# EAGLE board E-book_Reader (EAGLE 9.7.0)
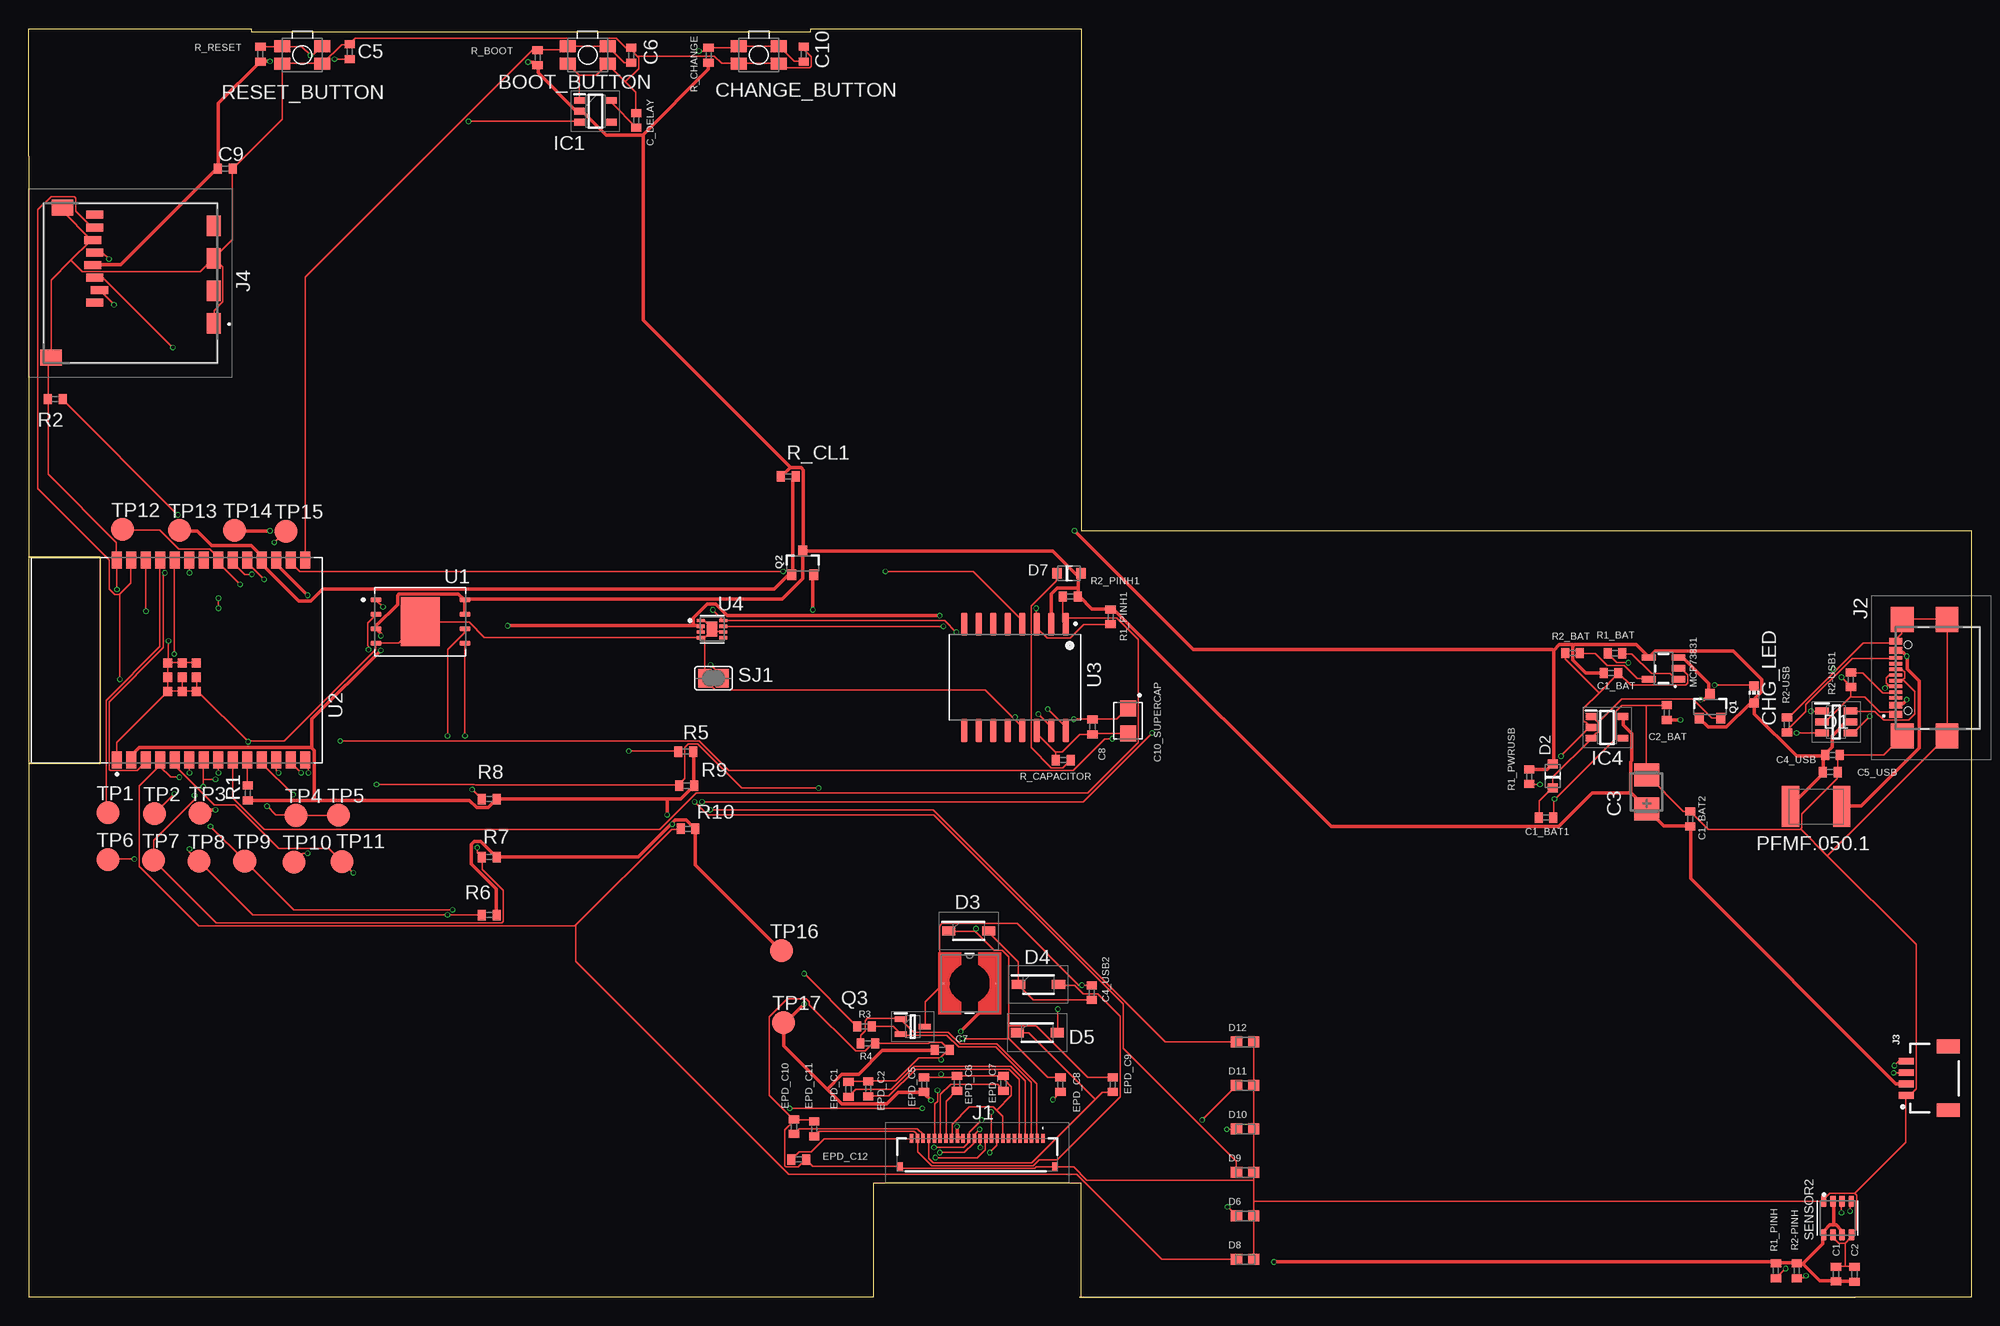
[diagram p1: board, top side]
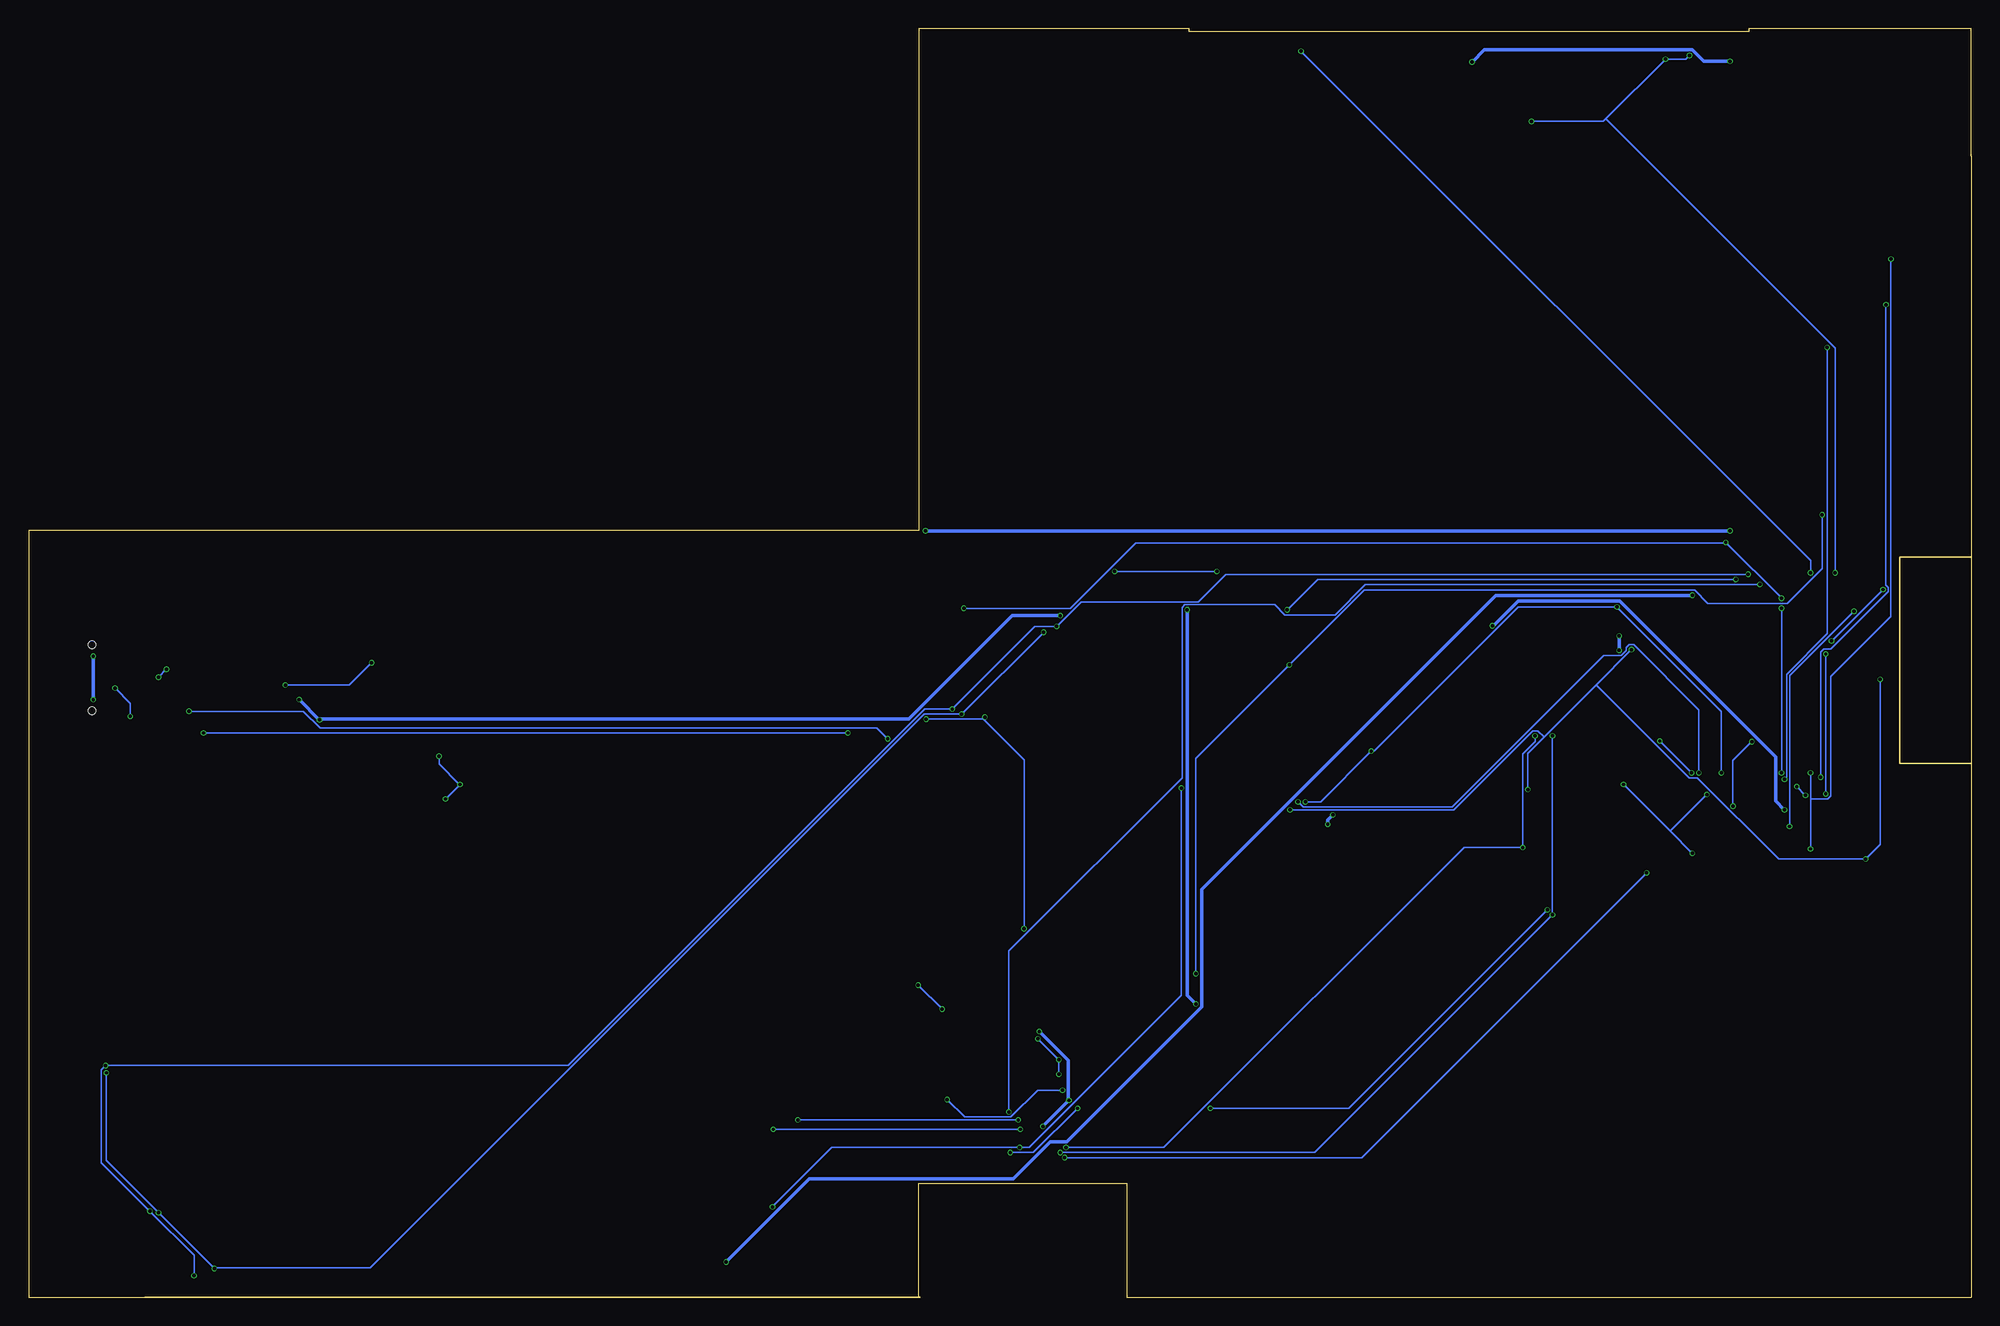
[diagram p2: board, bottom side, seen from below]

Size 170.2 x 111.2 mm. Coordinates in mm from the lower left corner, seen from the top.
Outline: 92.1,0 160,0
Outline: 0,64.9 0,100 0,111.2 19.5,111.2 19.5,110.9 68.5,110.9 68.5,111.2 92.2,111.2 92.2,67.2 170.2,67.2 170.2,0 92.1,0
Outline: 0,64.9 0,46.8
Outline: 0,46.8 0,0 74,0 74,10 92.2,10 92.2,0.1 92.1,0
Outline: 0,64.9 6.26,64.9 6.26,46.8 0,46.8
Copper layers (1*16): Top 0.035mm / dielectric 1.6mm / Bottom 0.035mm
Design rules "jlcpcb-2layers.dru *": minimum track width 5mil, minimum drill 0.3mm, track to track 5mil, track to pad 5mil, pad to pad 5mil, via to via 5mil, smd to smd 5mil, copper to edge 0.2mm, drill to drill 6mil, minimum pad ring 10mil, minimum via ring 3mil, stop-mask expansion 4mil, vias tented up to drill 0mil, thermal gap 10mil
Net classes: 1 power: width 0.3 mm

## Footprints (pad centres in the part's own frame; a part is rotated, then mirrored left to right if it is on the bottom)
MYBUTTON = smd 1.4 x 1.05: 1 1.75,0.75; 2 -1.75,0.75; 3 -1.75,-0.75; 4 1.75,-0.75
EAGLE-LTSPICE_C0402 = smd 0.7 x 0.9: 1 -0.65,0; 2 0.65,0
RCL_CT3528 = smd 2 x 2.2: + -1.5,0; - 1.5,0
CAPCP3225X100N = smd 1.4 x 1.4: 1 -1.1,0; 2 1.1,0
ADAFRUIT_CHIP-LED0603 = smd 0.8 x 0.8: A 0,-0.75; C 0,0.75
SOT95P280X145-6N = smd 1.2 x 0.6: 1 -1.25,0.95; 2 -1.25,0; 3 -1.25,-0.95; 4 1.25,-0.95; 5 1.25,0; 6 1.25,0.95
ESP32_WROVER_AVX---SD0805S020S1R0_AVX_SD0805S020S1R0_0 = smd 0.8 x 0.9: 1 -1.05,0; 2 1.05,0
SOD3716X135N = smd 1.15 x 0.8: 1 -1.75,0; 2 1.75,0
DIOC1608X36N = smd 0.97 x 0.94: 1 -0.75,0; 2 0.75,0
SOT95P280X125-5N = smd 0.9 x 0.6: 1 -1.4,0.95; 2 -1.4,0; 3 -1.4,-0.95; 4 1.4,-0.95; 5 1.4,0.95
SOT95P280X120-5N = smd 0.9 x 0.6: 1 -1.4,0.95; 2 -1.4,0; 3 -1.4,-0.95; 4 1.4,-0.95; 5 1.4,0.95
FH34SRJ24S05SH99 = smd 0.3 x 0.8: 1 5.75,1.45; 2 5.25,1.45; 3 4.75,1.45; 4 4.25,1.45; 5 3.75,1.45; 6 3.25,1.45; 7 2.75,1.45; 8 2.25,1.45; 9 1.75,1.45; 10 1.25,1.45; 11 0.75,1.45; 12 0.25,1.45; 13 -0.25,1.45; 14 -0.75,1.45; 15 -1.25,1.45; 16 -1.75,1.45; 17 -2.25,1.45; 18 -2.75,1.45; 19 -3.25,1.45; 20 -3.75,1.45; 21 -4.25,1.45; 22 -4.75,1.45; 23 -5.25,1.45; 24 -5.75,1.45 | smd 0.4 x 0.8: MP1 6.75,-1.05; MP2 -6.75,-1.05
SAMACSYS_PARTS_USB4110GFA = smd 0.3 x 1.15: A1 -3.35,3.678; A4 -2.55,3.678; A5 -1.25,3.678; A6 -0.25,3.678; A7 0.25,3.678; A8 1.25,3.678; A9 2.55,3.678; A12 3.35,3.678; B1 3.05,3.678; B4 2.25,3.678; B5 1.75,3.678; B6 0.75,3.678; B7 -0.75,3.678; B8 -1.75,3.678; B9 -2.25,3.678; B12 -3.05,3.678 | smd 2.18 x 2: MP1 -5.11,-0.827; MP2 5.11,-0.827; MP3 -5.11,3.103; MP4 5.11,3.103 | hole 0.65: -2.89,2.603; 2.89,2.603
JST04_1MM_RA = smd 0.6 x 1.35: 1 -1.5,0; 2 -0.5,0; 3 0.5,0; 4 1.5,0 | smd 1.2 x 2: NC1 2.8,-3.675; NC2 -2.8,-3.675
112ATAARR03ATTEND = smd 1.8 x 1.2: G1 10.6,10.4; G2 4.9,10.4; S1 7.75,10.4; S2 2.05,10.4 | smd 1.4 x 1.9: G3 13.6,-3.85; G4 0.45,-2.85 | smd 0.7 x 1.5: P1 8.8,0; P2 7.7,0.4; P3 6.6,0; P4 5.5,-0.2; P5 4.4,0; P6 3.3,-0.2; P7 2.2,0; P8 1.1,0
IND_4828-WE-TPC_WRE = smd 0.127 x 0.127: 1 -2.286,0; 2 2.286,0
ESP32_WROVER_SPARKFUN-IC-POWER_SOT23-5 = smd 0.55 x 1.2: 1 -0.95,-1.3; 2 0,-1.3; 3 0.95,-1.3; 4 0.95,1.3; 5 -0.95,1.3
ESP32C6_VARISTOR_CT/CN1812 = smd 1.5 x 3.6: 1 -2.25,0; 2 2.25,0
ESP32_WROVER_SPARKFUN-DISCRETESEMI_SOT23-3 = smd 0.8 x 0.9: 1 -0.95,-1; 2 0.95,-1; 3 0,1.1
SOT65P210X110-3N = smd 1.05 x 0.5: 1 -1.05,0.65; 2 -1.05,-0.65; 3 1.05,0
ESP32_WROVER_EAGLE-LTSPICE_R0402 = smd 0.7 x 0.9: 1 -0.65,0; 2 0.65,0
ESP32_WROVER_BME680_PSON80P300X300X100-8N = smd 1.016 x 0.5: 1 1.458,1.2; 2 1.458,0.4; 3 1.458,-0.4; 4 1.458,-1.2; 5 -1.458,-1.22; 6 -1.458,-0.4; 7 -1.458,0.4; 8 -1.458,1.2
SJ = smd 1.168 x 1.6: 1 -0.762,0; 2 0.762,0
TP20R = smd 2 x 2: TP 0,0
SON127P600X800X80-9N = smd 0.94 x 0.44: 1 -3.895,1.905; 2 -3.895,0.635; 3 -3.895,-0.635; 4 -3.895,-1.905; 5 3.895,-1.905; 6 3.895,-0.635; 7 3.895,0.635; 8 3.895,1.905 | smd 3.4 x 4.3: 9 0,0
XCVR_ESP32-C6-WROOM-1-N8 = smd 1.5 x 0.9: 1 -8.75,5.26; 2 -8.75,3.99; 3 -8.75,2.72; 4 -8.75,1.45; 5 -8.75,0.18; 6 -8.75,-1.09; 7 -8.75,-2.36; 8 -8.75,-3.63; 9 -8.75,-4.9; 10 -8.75,-6.17; 11 -8.75,-7.44; 12 -8.75,-8.71; 13 -8.75,-9.98; 14 -8.75,-11.25; 15 8.75,-11.25; 16 8.75,-9.98; 17 8.75,-8.71; 18 8.75,-7.44; 19 8.75,-6.17; 20 8.75,-4.9; 21 8.75,-3.63; 22 8.75,-2.36; 23 8.75,-1.09; 24 8.75,0.18; 25 8.75,1.45; 26 8.75,2.72; 27 8.75,3.99; 28 8.75,5.26 | smd 0.8 x 0.8: 29_1 -2.755,0.79; 29_2 -1.505,0.79; 29_3 -0.255,0.79; 29_4 -2.755,-0.46; 29_5 -1.505,-0.46; 29_6 -0.255,-0.46; 29_7 -2.755,-1.71; 29_8 -1.505,-1.71; 29_9 -0.255,-1.71
SOIC127P1032X265-16N = smd 2.05 x 0.59: 1 -4.655,4.445; 2 -4.655,3.175; 3 -4.655,1.905; 4 -4.655,0.635; 5 -4.655,-0.635; 6 -4.655,-1.905; 7 -4.655,-3.175; 8 -4.655,-4.445; 9 4.655,-4.445; 10 4.655,-3.175; 11 4.655,-1.905; 12 4.655,-0.635; 13 4.655,0.635; 14 4.655,1.905; 15 4.655,3.175; 16 4.655,4.445
SON50P200X200X80-9N = smd 0.76 x 0.27: 1 -0.985,0.75; 2 -0.985,0.25; 3 -0.985,-0.25; 4 -0.985,-0.75; 5 0.985,-0.75; 6 0.985,-0.25; 7 0.985,0.25; 8 0.985,0.75 | smd 0.9 x 1.3: 9 0,0

## Placement (x,y rotation side)
BOOT_BUTTON  BUTTON_CUSYOMV1  [MYBUTTON]  48.98,108.88 180 top
C1  100nF  [EAGLE-LTSPICE_C0402]  158.33,2.05 90 top
C1_BAT  4.7uF  [EAGLE-LTSPICE_C0402]  138.63,54.73 0 top
C1_BAT1  4.7uF  [EAGLE-LTSPICE_C0402]  132.93,42.05 0 top
C1_BAT2  4.7uF  [EAGLE-LTSPICE_C0402]  145.56,41.93 90 top
C2  100nF  [EAGLE-LTSPICE_C0402]  159.95,2.04 90 top
C2_BAT  4.7uF  [EAGLE-LTSPICE_C0402]  143.51,51.25 90 top
C3  100uF TANT  [RCL_CT3528]  141.74,44.3 90 top
C4_USB  100NF  [EAGLE-LTSPICE_C0402]  158.03,47.55 0 top
C4_USB2  4.7uF/25V  [EAGLE-LTSPICE_C0402]  93.13,26.71 90 top
C5  1uF  [EAGLE-LTSPICE_C0402]  28.13,109.16 90 top
C5_USB  4.7uF  [EAGLE-LTSPICE_C0402]  157.83,46.04 0 top
C6  100nF  [EAGLE-LTSPICE_C0402]  52.79,108.85 90 top
C7  10uF  [EAGLE-LTSPICE_C0402]  80.03,21.69 0 top
C8  100nF  [EAGLE-LTSPICE_C0402]  93.2,50 90 top
C9  100nF  [EAGLE-LTSPICE_C0402]  17.23,98.91 0 top
C10  100nF  [EAGLE-LTSPICE_C0402]  67.91,108.95 90 top
C10_SUPERCAP  CPH3225A  [CAPCP3225X100N]  96.32,50.53 270 top
C_DELAY  100nF  [EAGLE-LTSPICE_C0402]  53.23,103.15 90 top
CHANGE_BUTTON  BUTTON_CUSYOMV1  [MYBUTTON]  63.98,108.88 180 top
CHG_LED  [ADAFRUIT_CHIP-LED0603]  151.15,52.85 0 top
D1  USBLC6-2SC6Y  [SOT95P280X145-6N]  158.35,50.43 0 top
D2  ESP32_WROVER_AVX---SD0805S020S1R0_AVX_SD0805S020S1R0_0_0AVX_SD0805S020S1R0_0_0  [ESP32_WROVER_AVX---SD0805S020S1R0_AVX_SD0805S020S1R0_0]  133.53,45.71 90 top
D3  MBR0530  [SOD3716X135N]  82.37,32.13 0 top
D4  MBR0530  [SOD3716X135N]  88.47,27.42 0 top
D5  MBR0530  [SOD3716X135N]  88.37,23.21 0 top
D6  PGB1010603MR  [DIOC1608X36N]  106.57,7.15 0 top
D7  ESP32_WROVER_AVX---SD0805S020S1R0_AVX_SD0805S020S1R0_0_0AVX_SD0805S020S1R0_0_0  [ESP32_WROVER_AVX---SD0805S020S1R0_AVX_SD0805S020S1R0_0]  91.14,63.46 0 top
D8  PGB1010603MR  [DIOC1608X36N]  106.57,3.34 0 top
D9  PGB1010603MR  [DIOC1608X36N]  106.57,10.96 0 top
D10  PGB1010603MR  [DIOC1608X36N]  106.57,14.77 0 top
D11  PGB1010603MR  [DIOC1608X36N]  106.57,18.58 0 top
D12  PGB1010603MR  [DIOC1608X36N]  106.57,22.39 0 top
EPD_C1  1uF/50V  [EAGLE-LTSPICE_C0402]  71.83,18.25 90 top
EPD_C2  1uF/50V  [EAGLE-LTSPICE_C0402]  73.55,18.29 90 top
EPD_C5  1uF/50V  [EAGLE-LTSPICE_C0402]  78.45,18.65 90 top
EPD_C6  1uF/50V  [EAGLE-LTSPICE_C0402]  81.33,18.75 90 top
EPD_C7  1uF/50V  [EAGLE-LTSPICE_C0402]  85.41,18.75 90 top
EPD_C8  1uF/50V  [EAGLE-LTSPICE_C0402]  90.39,18.65 90 top
EPD_C9  1uF/50V  [EAGLE-LTSPICE_C0402]  94.97,18.65 90 top
EPD_C10  1uF/50V  [EAGLE-LTSPICE_C0402]  67.05,14.97 90 top
EPD_C11  1uF/50V  [EAGLE-LTSPICE_C0402]  68.83,14.77 90 top
EPD_C12  1uF/50V  [EAGLE-LTSPICE_C0402]  67.47,12.09 0 top
IC1  BD5229G-TR  [SOT95P280X125-5N]  49.66,103.95 0 top
IC4  XC6220A331MR-G  [SOT95P280X120-5N]  138.28,49.96 0 top
J1  FH34SRJ-24S-0.5SH_99_  [FH34SRJ24S05SH99]  83.11,12.49 0 top
J2  SAMACSYS_PARTS_USB4110-GF-A  [SAMACSYS_PARTS_USB4110GFA]  167.23,54.3 90 top
J3  QWIIC_RIGHT_ANGLE  [JST04_1MM_RA]  164.48,19.21 90 top
J4  112A-TAAR-R03_ATTEND  [112ATAARR03ATTEND]  5.82,95.97 270 top
L1  68uH  [IND_4828-WE-TPC_WRE]  82.44,27.52 0 top
MCP73831  ESP32_WROVER_SPARKFUN-IC-POWER_MCP73831  [ESP32_WROVER_SPARKFUN-IC-POWER_SOT23-5]  143.23,55.13 90 top
PFMF.050.1  ESP32C6_VARISTORCN1812  [ESP32C6_VARISTOR_CT/CN1812]  156.6,43.02 180 top
Q1  20V/4.2A/52mΩ/1.4W  [ESP32_WROVER_SPARKFUN-DISCRETESEMI_SOT23-3]  147.3,51.75 0 top
Q2  20V/4.2A/52mΩ/1.4W  [ESP32_WROVER_SPARKFUN-DISCRETESEMI_SOT23-3]  67.82,64.33 0 top
Q3  SI1308EDL-T1-GE3  [SOT65P210X110-3N]  77.46,23.73 0 top
R1  10k  [ESP32_WROVER_EAGLE-LTSPICE_R0402]  19.2,44.2 90 top
R1_BAT  200  [ESP32_WROVER_EAGLE-LTSPICE_R0402]  138.97,56.45 180 top
R1_PINH  10K  [ESP32_WROVER_EAGLE-LTSPICE_R0402]  153.07,2.35 90 top
R1_PINH1  10k  [ESP32_WROVER_EAGLE-LTSPICE_R0402]  94.79,59.65 90 top
R1_PWRUSB  100k  [ESP32_WROVER_EAGLE-LTSPICE_R0402]  131.47,45.63 90 top
R2  2.2  [ESP32_WROVER_EAGLE-LTSPICE_R0402]  2.33,78.73 0 top
R2-PINH  10K  [ESP32_WROVER_EAGLE-LTSPICE_R0402]  154.89,2.35 90 top
R2-USB  5k1  [ESP32_WROVER_EAGLE-LTSPICE_R0402]  154.03,50.18 90 top
R2-USB1  5k1  [ESP32_WROVER_EAGLE-LTSPICE_R0402]  159.64,54.13 90 top
R2_BAT  2k  [ESP32_WROVER_EAGLE-LTSPICE_R0402]  135.25,56.47 0 top
R2_PINH1  10k  [ESP32_WROVER_EAGLE-LTSPICE_R0402]  91.25,61.43 0 top
R3  0.47  [ESP32_WROVER_EAGLE-LTSPICE_R0402]  73.23,23.75 0 top
R4  10K  [ESP32_WROVER_EAGLE-LTSPICE_R0402]  73.53,22.27 0 top
R5  10k  [ESP32_WROVER_EAGLE-LTSPICE_R0402]  57.57,47.83 0 top
R6  10k  [ESP32_WROVER_EAGLE-LTSPICE_R0402]  40.37,33.51 0 top
R7  10k  [ESP32_WROVER_EAGLE-LTSPICE_R0402]  40.37,38.59 0 top
R8  10k  [ESP32_WROVER_EAGLE-LTSPICE_R0402]  40.37,43.67 0 top
R9  10k  [ESP32_WROVER_EAGLE-LTSPICE_R0402]  57.67,44.85 0 top
R10  10k  [ESP32_WROVER_EAGLE-LTSPICE_R0402]  57.77,41.07 0 top
R_BOOT  10K  [ESP32_WROVER_EAGLE-LTSPICE_R0402]  44.59,108.65 90 top
R_CAPACITOR  15  [ESP32_WROVER_EAGLE-LTSPICE_R0402]  90.65,47.09 0 top
R_CHANGE  10K  [ESP32_WROVER_EAGLE-LTSPICE_R0402]  59.57,108.85 90 top
R_CL1  10K  [ESP32_WROVER_EAGLE-LTSPICE_R0402]  66.55,71.95 0 top
R_RESET  10K  [ESP32_WROVER_EAGLE-LTSPICE_R0402]  20.31,108.95 90 top
RESET_BUTTON  BUTTON_CUSYOMV1  [MYBUTTON]  23.98,108.88 180 top
SENSOR2  ESP32_WROVER_BME680_BME680  [ESP32_WROVER_BME680_PSON80P300X300X100-8N]  158.47,6.96 90 top
SJ1  [SJ]  60,54.26 0 top
TP1  TPTP20R  [TP20R]  6.94,42.48 0 top
TP2  TPTP20R  [TP20R]  11.04,42.4 0 top
TP3  TPTP20R  [TP20R]  15.04,42.42 0 top
TP4  TPTP20R  [TP20R]  23.44,42.24 0 top
TP5  TPTP20R  [TP20R]  27.14,42.26 0 top
TP6  TPTP20R  [TP20R]  6.94,38.38 0 top
TP7  TPTP20R  [TP20R]  10.94,38.3 0 top
TP8  TPTP20R  [TP20R]  14.94,38.22 0 top
TP9  TPTP20R  [TP20R]  18.94,38.24 0 top
TP10  TPTP20R  [TP20R]  23.24,38.16 0 top
TP11  TPTP20R  [TP20R]  27.44,38.18 0 top
TP12  TPTP20R  [TP20R]  8.24,67.3 0 top
TP13  TPTP20R  [TP20R]  13.24,67.22 0 top
TP14  TPTP20R  [TP20R]  18.04,67.24 0 top
TP15  TPTP20R  [TP20R]  22.54,67.16 0 top
TP16  TPTP20R  [TP20R]  65.94,30.38 0 top
TP17  TPTP20R  [TP20R]  66.14,24.1 0 top
U1  W25Q512JVEIQ  [SON127P600X800X80-9N]  34.32,59.23 0 top
U2  ESP32-C6-WROOM-1-N8  [XCVR_ESP32-C6-WROOM-1-N8]  12.99,55.86 90 top
U3  DS3231SN#  [SOIC127P1032X265-16N]  86.42,54.35 270 top
U4  MAX17048G+T10  [SON50P200X200X80-9N]  59.88,58.57 0 top

## Tracks (layer width: path | path; a pad name or v marks a point on that pad's centre or on a via)
3V3  (via drill 0.3)
  Top 0.3: R6.2 40.96,33.53 40.96,35.81 38.8,37.97 38.8,39.69 39.05,39.94 39.62,39.94 40.96,38.61 R7.2 41.15,38.61 53.4,38.61 56.33,41.53 | TP16.TP 65.91,30.42 58.42,37.91 R10.2 58.29,41.15 57.59,41.85 56.64,41.85 56.33,41.53 | R5.2 58.23,47.82 58.29,47.75 58.29,44.9 R9.2 58.23,44.77 57.15,43.69 55.94,43.69 | 25.02,43.56 38.61,43.56 39.24,42.93 40.26,42.93 40.96,43.62 R8.2 41.15,43.69 55.94,43.69 | 25.02,43.56 19.24,43.56 R1.1 | 24.77,48.2 9.72,48.2 9.02,47.5 9.02,47.12 U2.2 | 24.77,48.2 25.02,47.94 25.02,43.56 | 55.94,43.69 v55.94,42.29 | v56.39,41.47 56.33,41.53 | 140.34,44.26 140.34,46.93 140.46,47.05 140.46,49.4 139.7,50.16 139.7,50.86 IC4.5 | 140.34,44.26 141.67,42.93 C3.+ 141.8,42.8 143.26,41.34 145.54,41.34 C1_BAT2.1 145.61,41.15 145.61,36.7 163.58,18.73 164.47,18.73 J3.2 | J4.P4 5.65,90.49 8.06,90.49 16.45,98.87 C9.1 16.64,98.93 16.64,104.65 20.26,108.27 R_RESET.1 20.45,108.33 v21.14,108.33 | 53.78,101.85 59.56,107.63 59.56,108.14 R_CHANGE.1 | 53.78,101.85 50.61,101.85 48.58,103.89 48.39,103.89 IC1.2 48.26,104.01 47.94,104.01 44.64,107.31 44.64,107.95 R_BOOT.1 44.45,108.01 44.2,108.27 v43.75,108.27 | U1.8 38.16,61.15 37.66,61.66 32.45,61.66 32.32,61.53 32.32,60.71 30.48,58.86 30.48,58.61 U1.3 30.54,58.48 30.86,58.17 v30.86,57.98 | U1.7 38.23,59.88 38.23,61.02 U1.8 | 66.74,72.71 66.04,72.01 65.91,72.01 R_CL1.1 | 66.74,72.71 67.69,72.71 67.88,72.52 67.88,65.47 Q2.3 | 91.95,62.17 91.95,63.25 92.14,63.44 D7.2 91.82,63.31 89.72,65.41 68.01,65.41 Q2.3 | 91.95,62.17 91.95,61.47 R2_PINH1.2 92.08,61.4 93.15,60.33 94.74,60.33 R1_PINH1.2 94.93,60.26 95.12,60.26 114.11,41.27 134.05,41.27 136.97,44.2 140.21,44.2 140.34,44.26
  Top 0.3: 91.95,62.17 90.11,62.17 89.6,61.66 89.6,59.05 U3.2 | U1.8 38.35,61.21 66.04,61.21 67.82,62.99 67.82,65.28 Q2.3 | 53.78,101.85 53.85,101.73 53.85,85.66 66.67,72.83 66.74,72.71 | v30.86,56.71 24.83,50.67 24.83,48.32 24.77,48.2
  Bottom 0.3: v56.39,41.47 56.39,41.85 v55.94,42.29 | v21.14,108.33 23.43,108.33 24.45,109.35 42.67,109.35 v43.75,108.27 | v30.86,57.98 v30.86,56.71
32KHZ
  Top 0.127: 90.61,59.56 90.61,59.24 90.81,59.05 U3.1 90.61,59.56 | 90.61,59.56 90.61,61.4 R2_PINH1.1 | 90.61,59.56 95.31,59.56 97.22,57.66 97.22,48.64 92.77,44.2 58.48,44.2 55.31,41.02 20.64,41.02 17.91,43.75 17.91,47.05 U2.9
DN  (via drill 0.3)
  Top 0.127: 162.91,53.69 162.75,53.85 162.75,54.29 163,54.55 163.51,54.55 J2.A7 | 162.91,53.69 163,53.59 163.51,53.59 J2.B7 | v161.29,50.93 159.89,49.53 159.64,49.53 D1.4 | 162.91,53.69 v162.62,53.4
  Bottom 0.127: v161.29,50.93 161.29,52.07 v162.62,53.4
DP
  Top 0.127: 164.18,54.13 164.34,54.29 164.34,54.8 164.15,54.99 163.58,54.99 J2.B6 | 164.18,54.13 164.15,54.1 163.58,54.1 J2.A6 | 164.18,54.13 165.23,53.09 165.23,51.12 164.72,50.61 162.5,50.61 161.73,51.37 159.64,51.37 D1.6
EPD_3V3  (via drill 0.3)
  Top 0.3: J1.15 81.85,13.97 81.41,13.97 J1.16 81.34,14.1 v81.34,14.99 | 69.94,18.26 66.17,22.04 66.17,24.07 TP17.TP 66.29,24.07 v67.94,25.72 | 69.94,18.26 71.25,16.95 75.18,16.95 76.2,17.97 78.42,17.97 EPD_C5.1 78.49,17.84 v79.06,17.27 | 69.94,18.26 71.25,19.56 72.71,19.56 74.8,21.65 79.38,21.65 C7.1 | v68.71,60.26 68.71,63.31 Q2.2 | v81.66,23.3 84.71,26.35 84.71,27.5 L1.2
  Bottom 0.3: v68.71,60.26 68.71,26.48 v67.94,25.72 | v81.34,14.99 v79.06,17.27 79.12,17.4 79.12,20.77 v81.66,23.3
EPD_3V3_C
  Top 0.3: R_CL1.2 67.18,71.94 66.93,71.69 66.93,63.37 Q2.1 66.74,63.31 66.55,63.31 65.34,62.1 25.78,62.1 24.7,61.02 23.69,61.02 20.51,64.2 20.51,64.52 U2.18 20.38,64.64 20.38,65.02 19.49,65.91 16.07,65.91 14.8,67.18 13.27,67.18 TP13.TP
EPD_BUSY  (via drill 0.3)
  Top 0.127: v84.2,12.7 84.84,13.34 84.84,13.91 J1.9 | v66.67,16.57 v78.3,16.57 | v37.15,33.97 23.24,33.97 18.99,38.23 TP9.TP 18.92,38.29 v15.94,41.27 | v10.29,60.13 10.29,64.58 U2.26
  Bottom 0.127: v84.2,12.7 82.17,12.7 v78.3,16.57 | v66.67,16.57 54.55,16.57 v37.15,33.97 | v10.29,60.13 15.94,54.48 v15.94,41.27
EPD_CS  (via drill 0.3)
  Top 0.127: v83.38,13.14 83.38,13.91 J1.12 | v105.03,7.94 105.79,7.18 D6.1 | v30.48,44.96 39.05,44.96 39.12,44.9 56.96,44.9 R9.1 56.96,44.96 57.47,45.47 57.47,48.2 57.78,48.51 58.61,48.51 62.48,44.64 v69.22,44.64 | v24.45,38.92 24,38.92 TP10.TP | v23.18,44.07 20.45,46.8 20.45,47.05 U2.11
  Bottom 0.127: v105.03,7.94 99.82,13.14 v83.38,13.14 82.55,13.14 69.22,26.48 v69.22,44.64 | v24.45,38.92 26.38,40.86 | 26.38,40.86 v30.48,44.96 | 26.38,40.86 v23.18,44.07
EPD_DC  (via drill 0.3)
  Top 0.127: v79.44,12.26 83.12,12.26 83.82,12.95 83.82,13.91 J1.11 | v28.45,37.21 27.5,38.16 TP11.TP 27.43,38.23 26.29,39.37 21.91,39.37 18.1,43.18 16.26,43.18 12.83,46.61 12.83,47.05 U2.5
  Bottom 0.127: v79.44,12.26 53.4,12.26 v28.45,37.21
EPD_RST  (via drill 0.3)
  Top 0.127: v84.33,16.26 84.33,13.97 J1.10 | v18.54,62.48 16.64,64.39 16.64,64.58 U2.21 16.57,64.64 16.57,64.9 15.88,65.6 13.14,65.6 11.49,67.25 8.26,67.25 TP12.TP
  Bottom 0.127: v84.33,16.26 84.33,30.35 69.15,45.53 69.15,60.45 68.9,60.71 61.02,60.71 60.13,59.82 55.75,59.82 53.09,62.48 v18.54,62.48
FLASH_CS  (via drill 0.3)
  Top 0.127: v52.58,47.88 56.9,47.88 R5.1 | v31.05,60.52 30.48,61.09 U1.1 | v58.36,43.43 59.5,42.29 79.31,42.29 95.89,25.72 95.89,21.84 105.79,11.94 105.79,10.99 D9.1 | v21.91,45.97 21.72,46.16 21.72,47.05 U2.12
  Bottom 0.127: v58.36,43.43 57.02,43.43 v52.58,47.88 52.32,47.88 39.69,60.52 v31.05,60.52 21.91,51.37 v21.91,45.97
GDR
  Top 0.127: J1.2 88.33,13.97 88.33,18.73 84.84,22.23 81.6,22.23 80.58,23.24 77.53,23.24 76.45,24.32 Q3.1 76.39,24.38 76.33,24.45 73.47,24.45 73.28,24.26 73.28,23.37 72.9,22.99 72.9,22.29 R4.1
GND  (via drill 0.3)
  Top 0.127: J4.G4 2.98,95.5 2.98,95.19 5.46,92.71 5.59,92.71 J4.P6 5.4,92.71 5.4,92.58 3.71,90.9 | 3.71,90.9 1.97,89.15 1.97,82.42 J4.G3 1.91,82.36 1.71,82.17 1.71,78.74 R2.1 1.71,78.68 1.71,72.14 7.68,66.17 7.68,64.64 U2.28 7.75,64.58 v7.75,62.04 | C10.2 67.94,109.54 67.94,109.35 68.58,108.71 68.58,107.89 68.45,107.76 66.1,107.76 65.79,108.08 CHANGE_BUTTON.2 65.72,108.14 62.23,108.14 | IC1.1 48.26,107.06 48.23,107.09 | 48.23,107.09 47.24,108.08 BOOT_BUTTON.1 | 52.29,106.52 50.74,108.08 BOOT_BUTTON.2 49.72,107.12 48.26,107.12 48.23,107.09 | 52.29,106.52 53.21,105.6 53.21,103.82 C_DELAY.2 | 53.37,108.74 53.47,108.65 53.47,107.7 52.29,106.52 | 53.37,108.74 52.83,109.28 52.83,109.47 C6.2 52.77,109.54 52.32,109.54 51.5,110.36 28.64,110.36 28.13,109.86 C5.2 28.07,109.79 27.43,109.79 25.78,108.14 RESET_BUTTON.2 25.72,108.14 22.29,108.14 RESET_BUTTON.1 22.23,108.08 22.23,103.25 17.91,98.93 C9.2 17.84,98.87 17.84,92.71 16.26,91.12 J4.G2 | 62.23,108.14 60.71,108.14 60.07,108.78 53.4,108.78 53.37,108.74 | 62.23,108.14 CHANGE_BUTTON.1 | J4.G1 16.26,85.41 16.26,86.49 17.02,87.25 17.02,90.3 16.26,91.06 J4.G2 | 3.71,90.9 4.7,89.92 15.05,89.92 16.19,91.06 J4.G2 | J2.A1 163.58,50.99 163.58,51.24 J2.B12 163.51,51.31 162.18,51.31 160.84,52.64 159.64,52.64 159.61,52.67 | 159.61,52.67 157.42,50.48 157.16,50.48 D1.2 | 159.61,52.67 159.64,52.7 159.64,53.47 R2-USB1.1 159.64,53.53 v158.81,54.36 | 158.27,54.9 160.72,57.34 163.51,57.34 J2.B1 163.58,57.4 163.58,57.59 J2.A12 163.58,57.66 164.08,58.17 164.08,59.37 J2.MP4 164.15,59.44 168.02,59.44 J2.MP2 168.08,59.37 168.08,49.21 J2.MP1 168.02,49.15 157.57,38.7
  Top 0.127: 158.27,54.9 154.24,50.86 154.05,50.86 R2-USB.2 | 158.27,54.9 v158.12,55.05 | 159.13,2.73 159.89,2.73 C2.2 | 159.13,2.73 158.37,2.73 C1.2 | 159.13,4.76 158.56,4.76 158.12,5.21 158.12,5.46 SENSOR2.7 | 159.13,4.76 159.64,5.27 159.64,5.46 SENSOR2.5 159.7,5.52 160.15,5.97 160.15,8.95 159.99,9.11 | 159.99,9.11 159.96,9.14 157.8,9.14 157.29,8.64 157.29,8.45 SENSOR2.1 157.23,8.45 107.31,8.45 | 159.99,9.11 164.47,13.59 164.47,17.65 J3.1 164.53,17.72 164.78,17.72 165.35,18.29 165.35,30.92 157.57,38.7 | 159.13,4.76 159.13,2.73 | 137.57,52.99 139.26,54.67 C1_BAT.2 139.32,54.67 140.34,53.66 145.16,53.66 145.35,53.85 145.35,54.55 144.78,55.12 144.59,55.12 MCP73831.2 | 137.57,52.99 136.21,51.63 136.21,50.55 136.33,50.42 136.4,50.42 136.84,49.97 IC4.2 136.78,49.97 v134.24,47.43 | 137.57,52.99 134.62,55.94 134.62,56.45 R2_BAT.1 | J2.MP3 164.08,49.15 162.5,47.56 158.69,47.56 C4_USB.2 158.62,47.5 158.5,47.37 158.5,46.1 C5_USB.2 158.43,46.04 158.43,45.47 155.32,42.35 155.32,41.15 155.23,41.05 | 133.7,43.66 139,48.96 139,51.31 139.57,51.88 141.73,51.88 | 133.7,43.66 133.6,43.56 133.6,42.1 C1_BAT1.2 | 141.73,51.88 143.51,51.88 C2_BAT.2 | v132.4,44.96 131.51,44.96 R1_PWRUSB.1 | v133.67,43.69 133.7,43.66 | 141.73,51.88 141.73,45.85 C3.- 141.8,45.78 144.97,42.61 145.54,42.61 C1_BAT2.2 145.61,42.55 147.13,41.02 155.19,41.02 155.23,41.05 | 155.23,41.05 157.57,38.7 | 85.88,22.7 85.85,22.73 85.85,23.75 85.88,23.78 | 85.88,22.7 89.28,19.3 90.36,19.3 EPD_C8.2 | 85.88,23.78 85.92,23.81 88.27,23.81 92.77,19.3 94.93,19.3 EPD_C9.2 | 82.96,32.04 84.58,30.42 85.28,30.42 85.85,29.84 85.85,23.81 85.88,23.78
  Top 0.127: 82.96,32.04 82.93,32.07 80.64,32.07 D3.1 | D12.2 107.31,22.35 107.31,18.61 D11.2 107.31,18.54 107.31,14.8 D10.2 107.31,14.73 107.31,10.99 D9.2 107.31,10.92 107.31,10.29 | D8.2 107.31,3.37 107.31,7.11 D6.2 107.31,7.18 107.31,8.45 | 107.31,10.29 107.31,8.45 | 79.95,19.3 81.22,19.3 81.28,19.37 EPD_C6.2 81.34,19.43 85.41,19.43 EPD_C7.2 85.47,19.37 85.47,19.11 86.11,18.48 86.11,17.72 84.8,16.41 | 79.95,19.3 78.49,19.3 EPD_C5.2 | 84.8,16.41 85.34,15.88 85.34,13.97 J1.8 | 84.8,16.41 84.52,16.7 82.42,16.7 80.9,15.18 80.9,13.97 J1.17 | EPD_C1.2 71.88,18.92 73.53,18.92 EPD_C2.2 73.6,18.99 75.95,18.99 77.98,21.02 79.88,21.02 79.92,21.05 | 79.92,21.05 80.58,21.72 C7.2 80.64,21.72 80.01,22.35 78.93,22.35 78.87,22.29 74.23,22.29 R4.2 74.17,22.23 73.91,22.23 73.28,21.59 72.45,21.59 68.39,25.65 68.39,25.91 68.14,26.16 66.48,26.16 64.9,24.57 64.9,17.72 66.99,15.62 EPD_C10.2 | EPD_C10.2 67.06,15.56 68.64,15.56 68.77,15.43 EPD_C11.2 | EPD_C10.2 67.06,15.49 66.23,14.67 66.23,11.56 66.36,11.43 67.44,11.43 68.07,12.06 EPD_C12.2 68.14,12.06 68.71,11.49 76.33,11.49 J1.MP2 76.39,11.43 76.52,11.3 88.14,11.3 88.27,11.43 J1.MP1 89.92,11.43 91.57,11.43 92.71,10.29 107.31,10.29 | v79.95,19.56 79.95,19.3 | v79.95,20.83 79.95,21.02 79.92,21.05 | v81.79,22.67 85.85,22.67 85.88,22.7 | C10_SUPERCAP.1 96.27,51.63 95.31,50.67 93.22,50.67 C8.2 93.15,50.67 v91.57,50.67 | 59.24,57.85 58.93,57.85 U4.4 | 59.24,57.85 59.82,58.42 59.82,58.55 U4.9 | U4.6 60.83,58.36 59.82,58.36 U4.9 | U4.1 58.93,59.31 59.18,59.31 59.88,58.61 U4.9 | 59.24,57.85 59.24,54.29 SJ1.1 59.24,54.23 59.24,54.1 60.13,53.21 83.82,53.21 86.3,50.74
  Top 0.127: 59.24,57.85 U4.4 | 86.3,50.74 87,50.04 87,49.72 U3.13 | 86.3,50.74 v86.42,50.86 | TP5.TP 27.11,42.23 23.5,42.23 TP4.TP 23.43,42.29 21.65,42.29 v20.89,43.05 | U2.29_3 12.26,55.63 13.4,55.63 U2.29_6 13.46,55.63 14.67,55.63 U2.29_9 | U2.29_7 14.73,53.15 14.73,54.29 U2.29_8 | U2.29_1 12.19,53.15 12.19,54.29 U2.29_2 12.19,54.42 12.19,55.56 U2.29_3 | U2.29_4 13.46,53.15 13.46,54.29 U2.29_5 | U2.29_1 12.26,53.15 13.4,53.15 U2.29_4 | U2.29_7 14.67,53.15 13.53,53.15 U2.29_4 | U2.1 7.75,47.12 7.75,48.64 12.19,53.09 U2.29_1 | U2.29_7 14.8,53.15 v19.24,48.7 19.24,48.77 22.42,48.77 30.42,56.77 30.42,57.28 U1.4 30.48,57.34 32.45,57.34 34.29,59.18 U1.9 34.35,59.18 38.61,59.18 39.94,57.85 58.86,57.85 U4.4 | v83,32.32 83,32.07 82.96,32.04 | v12.26,57.53 12.26,55.69 U2.29_3
  Bottom 0.127: v158.12,55.05 v158.81,54.36 | v133.67,43.69 v132.4,44.96 132.46,44.96 134.24,46.74 v134.24,47.43 | v79.95,19.56 v79.95,20.83 v81.79,22.67 | v91.57,50.67 86.61,50.67 v86.42,50.86 86.55,50.67 83,47.12 v83,32.32 | v20.89,43.05 20.89,47.05 v19.24,48.7 | v12.26,57.53 v7.75,62.04
GPIO8
  Top 0.127: R1.2 19.18,44.9 19.18,47.05 U2.10
I2C_PW  (via drill 0.3)
  Top 0.3: 158.12,6.35 158.37,6.35 158.81,5.91 158.81,5.52 SENSOR2.6 | 158.12,6.35 157.8,6.35 157.29,5.84 157.29,5.52 SENSOR2.8 157.16,5.4 157.16,4.7 155.51,3.05 155.45,2.92 | 158.12,6.35 158.12,8.38 SENSOR2.2 | C2.1 159.89,1.4 158.37,1.4 C1.1 158.24,1.46 156.91,1.46 155.45,2.92 | 155.45,2.92 155,2.92 R2-PINH.2 154.88,3.05 153.1,3.05 R1_PINH.2 152.97,3.11 v109.09,3.11 | v24.45,61.53 21.72,64.26 21.72,64.58 U2.17
  Bottom 0.3: v24.45,61.53 41.66,61.53 67.44,35.75 67.44,25.46 79.25,13.65 80.71,13.65 83.95,10.41 101.79,10.41 v109.09,3.11
INT_RTC  (via drill 0.3)
  Top 0.127: R1_PINH1.1 94.74,58.99 92.46,58.99 91.25,57.78 89.22,57.78 88.33,58.67 88.33,58.99 U3.3 88.27,59.05 v88.27,60.39 | v16.64,45.97 16.64,47.05 U2.8 | v16.64,61.28 v16.64,60.39 | v21.53,66.17 22.48,67.12 TP15.TP
  Bottom 0.127: v16.64,60.39 v16.64,45.97 | v16.64,61.28 v21.53,66.17 21.53,66.1 73.22,66.1 78.93,60.39 v88.27,60.39
IO/BOOT
  Top 0.127: C6.1 52.77,108.2 52.2,108.2 50.74,109.67 BOOT_BUTTON.3 50.67,109.67 47.24,109.67 BOOT_BUTTON.4 47.18,109.6 46.93,109.35 44.64,109.35 R_BOOT.2 44.58,109.28 44.13,109.28 24.26,89.41 24.26,64.64 U2.15
IO/CHANGE  (via drill 0.3)
  Top 0.127: C10.1 67.88,108.33 67.06,108.33 65.79,109.6 CHANGE_BUTTON.3 65.72,109.67 62.23,109.67 CHANGE_BUTTON.4 62.23,109.6 62.17,109.54 59.63,109.54 R_CHANGE.2 59.56,109.47 59.31,109.22 v58.74,109.22 | v14.1,63.5 14.1,64.58 U2.23
  Bottom 0.127: v14.1,63.5 14.1,64.58 v58.74,109.22
MISO  (via drill 0.3)
  Top 0.127: 7.97,61.63 8.95,62.61 8.95,64.58 U2.27 | 7.97,61.63 7.94,61.59 7.56,61.59 7.05,62.1 7.05,64.64 0.83,70.87 0.83,95.31 1.97,96.46 4,96.46 4.13,96.33 4.13,95.19 5.52,93.79 5.78,93.79 J4.P7 | v38.86,44.51 39.69,43.69 R8.1 | v29.78,56.77 29.78,57.02 29.72,57.09 29.72,59.12 30.42,59.82 U1.2 | v59.69,42.74 79.25,42.74 99.57,22.42 105.79,22.42 D12.1 | v9.27,38.42 6.99,38.42 TP6.TP | v8,54.17 8,61.59 7.97,61.63
  Bottom 0.127: v38.86,44.51 38.86,47.69 37.43,49.12 | v29.78,56.77 32.86,53.69 | 32.86,53.69 37.43,49.12 | v59.69,42.74 45.34,42.74 38.42,49.66 37.97,49.66 37.43,49.12 | 32.86,53.69 24.7,45.53 24,45.53 16.89,38.42 v9.27,38.42 8,39.69 v8,54.17
MOSI  (via drill 0.3)
  Top 0.127: v83.5,15.56 82.42,14.48 82.42,13.97 J1.14 82.36,13.91 82.36,13.59 81.92,13.14 v79.31,13.14 | v102.81,15.56 105.79,18.54 D11.1 | v38.23,49.21 38.23,57.28 U1.5 | v39.31,39.43 39.31,38.99 39.69,38.61 R7.1 39.75,38.54 39.75,37.53 41.59,35.69 41.59,32.96 41.47,32.83 16.45,32.83 10.99,38.29 TP7.TP 10.99,38.35 10.99,40.07 14.54,43.62 v14.54,44.01 | v15.3,44.77 15.3,45.4 | 15.3,45.4 15.3,47.05 U2.7 | v12.64,83.25 6.54,89.34 5.84,89.34 J4.P3 | 15.3,45.4 v16.38,45.4
  Bottom 0.127: v102.81,15.56 v83.5,15.56 | v38.23,49.21 38.23,48.7 39.31,47.62 v39.31,39.43 44.45,39.43 70.74,13.14 v79.31,13.14 | v14.54,44.01 v15.3,44.77 | v12.64,83.25 12.64,58.17 16.19,54.61 16.19,45.59 v16.38,45.4
N$1
  Top 0.127: R2-USB.1 154.05,49.53 154.05,49.72 155.7,51.37 155.7,51.94 159.77,56.01 163.51,56.01 J2.B5
N$3
  Top 0.127: R1_BAT.1 139.64,56.39 140.46,56.39 142.18,54.67 143.83,54.67 144.27,54.23 144.53,54.23 MCP73831.1
N$4
  Top 0.127: R2-USB1.2 159.7,54.74 160.66,54.74 162.43,52.96 163.45,52.96 163.51,53.02 J2.A5
N$5
  Top 0.127: J1.24 77.34,13.91 69.72,13.91 68.58,12.76 67.5,12.76 66.86,12.13 EPD_C12.1
N$6  (via drill 0.3)
  Top 0.127: v79.63,18.16 79.63,17.21 79.38,16.95 79.38,13.97 J1.20 | EPD_C8.1 v89.72,17.34
  Bottom 0.127: v79.63,18.16 81.79,18.16 84.14,15.81 88.2,15.81 v89.72,17.34
N$7
  Top 0.127: J1.22 78.36,13.97 78.36,14.29 77.85,14.8 67.5,14.8 67.06,14.35 EPD_C10.1
N$10
  Top 0.127: J1.19 79.88,13.97 79.88,17.78 80.77,18.67 84.9,18.67 85.41,18.16 EPD_C7.1
N$12
  Top 0.127: C1_BAT1.1 132.33,42.1 132.33,43.5 133.48,44.64 D2.1 133.54,44.7 133.54,45.59 136.91,48.96 IC4.3 136.91,49.02 137.35,49.47 137.41,49.47 137.54,49.59 137.54,50.35 137.51,50.39 | 137.51,50.39 137.03,50.86 136.91,50.86 IC4.1 | 137.51,50.39 139.57,52.45 145.8,52.45 147.45,50.8 148.21,50.8 Q1.2
N$13
  Top 0.127: J1.18 80.39,13.97 80.39,17.21 81.28,18.1 EPD_C6.1
N$17
  Top 0.127: C4_USB2.1 93.09,26.1 88.01,26.1 86.74,27.37 D4.1 86.68,27.43 86.68,29.4 84.14,31.94 84.14,32.07 D3.2
N$25  (via drill 0.3)
  Top 0.127: v147.7,53.66 151.13,53.66 CHG_LED.C | v140.14,55.63 139.13,55.63 138.37,56.39 R1_BAT.2
  Bottom 0.127: v147.7,53.66 142.11,53.66 v140.14,55.63
N$27
  Top 0.127: R2_BAT.2 135.95,56.45 137.22,56.45 138.3,55.37 139.76,55.37 140.91,54.23 141.92,54.23 MCP73831.5
N$37
  Top 0.127: J1.4 87.31,13.97 87.31,18.99 86.04,20.26 77.6,20.26 75.56,18.22 72.45,18.22 71.88,17.65 EPD_C1.1
N$38
  Top 0.127: J1.5 86.81,13.97 86.81,19.11 85.92,20 77.72,20 75.37,17.65 73.6,17.65 EPD_C2.1
N$46
  Top 0.127: IC1.5 51.12,104.84 51.12,104.65 53.21,102.55 C_DELAY.1
N$50
  Top 0.127: D7.1 90.04,63.44 90.04,62.8 87.82,60.58 87.82,48.2 89.6,46.42 90.61,46.42 91.25,47.05 R_CAPACITOR.2
PREVGH
  Top 0.127: 93.44,17.37 94.04,17.97 94.93,17.97 EPD_C9.1 | 93.44,17.37 87.88,11.81 79.25,11.81 78.87,12.19 78.87,13.91 J1.21 | 93.44,17.37 87.63,23.18 86.68,23.18 D5.1
PREVGL
  Top 0.127: EPD_C11.1 68.83,14.16 69.22,14.54 77.6,14.54 77.85,14.29 77.85,13.97 J1.23 77.92,13.91 77.92,12.76 79.12,11.56 88.01,11.56 88.52,12.06 90.11,12.06 95.63,17.59 95.63,24.64 93.66,26.61 92.39,26.61 91.63,27.37 90.23,27.37 D4.2
RESE
  Top 0.127: J1.3 87.82,13.97 87.82,18.86 84.71,21.97 81.47,21.97 80.45,22.99 76.52,22.99 76.45,23.05 Q3.2 76.39,23.11 75.75,23.75 73.91,23.75 R3.2
RESE'  (via drill 0.3)
  Top 0.127: v13.08,68.58 2.98,78.68 R2.2 | v59.75,55.44 60.71,54.48 60.71,54.29 SJ1.2 | v67.94,28.38 72.52,23.81 R3.1
  Bottom 0.127: v13.08,68.58 13.08,63.88 16.13,60.83 23.11,60.83 24.26,61.98 53.21,61.98 v59.75,55.44 67.94,47.24 v67.94,28.38
RESET  (via drill 0.3)
  Top 0.127: R_RESET.2 22.23,109.6 RESET_BUTTON.4 22.29,109.6 23.94,109.6 v24.7,108.84 24.89,108.84 25.72,109.67 RESET_BUTTON.3 | v26.8,108.52 28.07,108.52 C5.1 | v38.54,103.06 48.26,103.06 IC1.3 | v11.94,63.5 11.81,63.37 11.81,56.96 7.05,52.2 7.05,46.29 7.18,46.16 9.53,46.16 10.22,46.86 10.22,47.05 U2.3
  Bottom 0.127: v24.7,108.84 25.02,108.52 v26.8,108.52 32.04,103.28 | v38.54,103.06 32.26,103.06 32.04,103.28 | v11.94,63.5 11.94,83.19 32.04,103.28
RTC_RST  (via drill 0.3)
  Top 0.127: v66.1,63.63 23.75,63.63 22.99,64.39 22.99,64.58 U2.16 | v75.06,63.63 82.74,63.63 87,59.37 87,59.05 U3.4
  Bottom 0.127: v75.06,63.63 v66.1,63.63
RX  (via drill 0.3)
  Top 0.127: v12.76,56.39 12.76,64.58 U2.24 | v12.76,44.13 11.05,42.42 TP2.TP
  Bottom 0.127: v12.76,44.13 v12.76,56.39
SCK  (via drill 0.3)
  Top 0.127: v83.31,14.73 82.87,14.29 82.87,13.97 J1.13 82.8,13.91 82.8,13.53 81.98,12.7 v79.82,12.7 | v104.97,14.73 105.79,14.73 D10.1 | R6.1 39.69,33.53 v36.7,33.53 19.62,33.53 14.99,38.16 TP8.TP 14.92,38.23 14.1,39.05 v14.1,39.31 | v36.7,49.21 36.7,56.77 38.16,58.23 38.16,58.55 U1.6 | v14.1,45.97 14.1,47.05 U2.6 | v7.05,91 6.48,91.57 5.84,91.57 J4.P5
  Bottom 0.127: v104.97,14.73 v83.31,14.73 | v36.7,49.21 v36.7,33.53 57.53,12.7 v79.82,12.7 | v14.1,39.31 14.1,43.69 | 14.1,43.69 v14.1,45.97 | v7.05,91 7.05,59.69 12.32,54.42 12.32,43.94 12.57,43.69 14.1,43.69
SCL  (via drill 0.3)
  Top 0.127: v155.7,1.91 155.51,1.71 154.94,1.71 R2-PINH.1 | v159.58,7.56 159.58,8.32 159.64,8.38 SENSOR2.4 | v163.45,20.32 163.83,20.7 164.47,20.7 J3.4 | v80.14,58.8 60.9,58.8 U4.7 | v89.28,51.56 90.81,50.04 90.81,49.72 U3.16 | v19.56,63.37 18.92,63.37 17.91,64.39 17.91,64.58 U2.20
  Bottom 0.127: v155.7,1.91 155.7,3.68 v159.58,7.56 163.83,11.81 163.83,19.94 v163.45,20.32 122.94,20.32 91.69,51.56 v89.28,51.56 82.04,58.8 v80.14,58.8 77.98,60.96 67.75,60.96 65.34,63.37 v19.56,63.37
SDA  (via drill 0.3)
  Top 0.127: v153.92,2.54 153.1,1.71 R1_PINH.1 | v158.81,7.43 158.81,8.38 SENSOR2.3 | v163.39,19.68 164.47,19.68 J3.3 | v81.28,58.29 80.26,59.31 60.9,59.31 U4.8 60.83,59.37 v59.94,60.26 | v88.46,51.12 89.53,50.04 89.53,49.72 U3.15 | v20.64,62.93 19.18,64.39 19.18,64.58 U2.19
  Bottom 0.127: v163.39,19.68 163.39,12 v158.81,7.43 v153.92,2.54 153.92,2.6 140.27,2.6 91.76,51.12 v88.46,51.12 v81.28,58.29 | v20.64,62.93 57.28,62.93 v59.94,60.26
SRC  (via drill 0.3)
  Top 0.127: C4_USB2.2 93.09,27.37 v92.27,27.37 92.01,27.37 86.61,32.77 80.01,32.77 79.82,32.58 79.82,27.88 80.14,27.56 L1.1 80.14,27.5 78.55,25.91 78.55,23.75 Q3.3 | v90.17,25.27 90.17,23.24 D5.2
  Bottom 0.127: v92.27,27.37 v90.17,25.27
SS_SD  (via drill 0.3)
  Top 0.127: 47.91,32.61 47.88,32.58 14.92,32.58 9.72,37.78 9.72,44.83 11.49,46.61 11.49,47.05 U2.4 11.49,46.55 12.45,45.59 v13.21,45.59 | 47.91,32.61 56.33,41.02 57.09,41.02 R10.1 | D8.1 105.79,3.37 99.25,3.37 91.82,10.79 66.61,10.79 47.94,29.46 47.94,32.58 47.91,32.61 | v7.49,87 J4.P2
  Bottom 0.127: v7.49,87 7.49,62.42 7.3,62.23 7.3,61.85 12.32,56.83 12.95,56.83 13.21,56.58 v13.21,45.59
TX
  Top 0.127: U2.25 11.49,64.58 11.49,57.02 6.79,52.32 6.79,42.61 6.92,42.48 TP1.TP
USB_D+  (via drill 0.3)
  Top 0.127: v156.15,51.37 D1.1 | v94.93,48.96 94.3,48.96 91.5,46.16 61.34,46.16 58.74,48.77 v27.3,48.77 | v24.51,45.97 24.51,46.8 24.26,47.05 U2.14
  Bottom 0.127: v156.15,51.37 146.11,51.37 144.65,49.91 95.89,49.91 v94.93,48.96 | v24.51,45.97 v27.3,48.77
USB_D-  (via drill 0.3)
  Top 0.127: v154.88,49.47 157.1,49.47 D1.3 | v98.42,49.47 92.39,43.43 v58.99,43.43 | v23.88,45.97 22.99,46.86 22.99,47.05 U2.13
  Bottom 0.127: v98.42,49.47 v154.88,49.47 | v58.99,43.43 58.55,42.99 45.47,42.99 32.19,56.26 30.67,56.26 30.23,56.71 30.23,56.96 29.97,57.21 29.59,57.21 23.88,51.5 v23.88,45.97
VBAT  (via drill 0.3)
  Top 0.3: v144.72,50.61 C2_BAT.1 | v146.49,52.39 146.81,52.39 147.26,52.83 Q1.3 147.19,52.96 147.19,53.78 144.91,56.07 144.59,56.07 MCP73831.3 | U4.3 58.93,58.36 58.93,58.8 U4.2 58.8,58.86 58.23,58.86 | v41.97,58.86 58.23,58.86 | v16.38,42.74 15.3,42.74 15.05,42.48 TP3.TP | v79.82,59.75 61.21,59.75 60.2,60.77 59.44,60.77 58.23,59.56 58.23,58.86
  Bottom 0.3: v146.49,52.39 v144.72,50.61 144.59,50.67 93.09,50.67 84.01,59.75 v79.82,59.75 | v41.97,58.86 41.85,58.86 39.69,61.02 30.8,61.02 17.14,47.37 17.14,43.5 v16.38,42.74
VBUS  (via drill 0.3)
  Top 0.3: CHG_LED.A 151.13,52.07 150.81,52.07 148.72,49.97 147.13,49.97 146.37,50.74 Q1.1 | C4_USB.1 157.35,47.5 157.23,47.37 157.23,46.1 C5_USB.1 157.23,45.91 154.37,43.05 PFMF.050.1.2 | D1.5 159.58,50.42 159.19,50.42 157.99,49.21 157.99,48.26 157.42,47.69 C4_USB.1 | CHG_LED.A 151.19,51.94 151.19,51.12 154.88,47.43 157.1,47.43 C4_USB.1 | R1_PWRUSB.2 131.51,46.29 133.03,46.29 133.48,46.74 D2.2 133.6,46.86 133.6,56.71 | 135.35,57.12 135.45,57.21 140.84,57.21 141.92,56.13 MCP73831.4 142.05,56.2 142.49,56.64 149.35,56.64 151.83,54.17 151.83,53.09 151.26,52.51 151.26,52.2 CHG_LED.A | 135.35,57.12 135.25,57.02 135.25,55.88 136.4,54.74 137.92,54.74 C1_BAT.1 | 133.6,56.71 134.11,57.21 135.25,57.21 135.35,57.12 | v21.14,67.18 18.1,67.18 TP14.TP | v91.63,67.18 102.04,56.77 133.48,56.77 133.6,56.71
  Bottom 0.3: v91.63,67.18 v21.14,67.18
VRTC
  Top 0.127: C10_SUPERCAP.2 96.27,49.4 93.22,49.4 C8.1 93.15,49.34 92.08,49.34 90.55,47.82 89.98,47.82 89.95,47.78 | 89.95,47.78 88.33,49.4 88.33,49.66 U3.14 | 89.95,47.78 89.98,47.75 89.98,47.12 R_CAPACITOR.1
VUSB  (via drill 0.3)
  Top 0.3: J2.A4 163.58,51.75 163.58,52.01 J2.B9 163.7,52.07 164.21,52.07 v164.53,52.39 | J2.A9 163.58,56.83 163.58,56.58 J2.B4 163.7,56.52 164.21,56.52 v164.53,56.2 164.59,56.07 164.59,55.05 165.61,54.04 165.61,48.13 160.53,43.05 158.88,43.05 PFMF.050.1.1
  Bottom 0.3: v164.53,56.2 v164.53,52.39